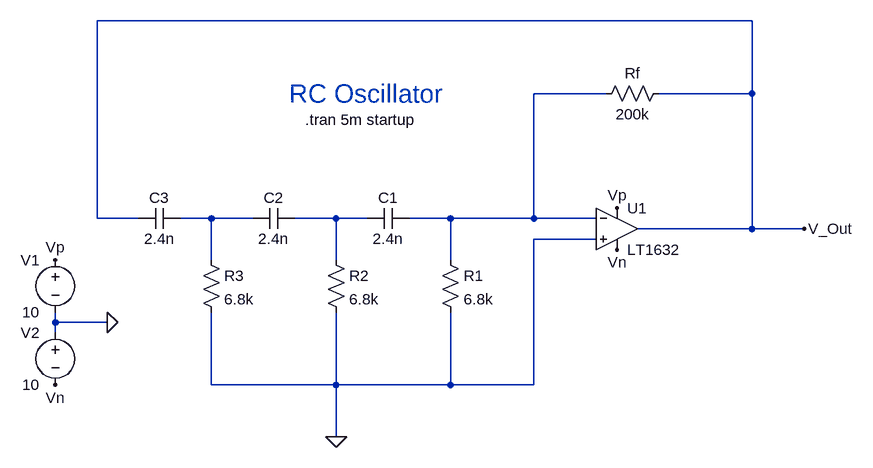
[diagram p0: schematic RC_Oscillator.asc]
RC_Oscillator.asc, the LTspice schematic file:
Version 4.1
SHEET 1 880 680
WIRE 480 -192 -528 -192
WIRE 256 -80 144 -80
WIRE 480 -80 480 -192
WIRE 480 -80 336 -80
WIRE -528 112 -528 -192
WIRE -464 112 -528 112
WIRE -352 112 -400 112
WIRE -288 112 -352 112
WIRE -160 112 -224 112
WIRE -112 112 -160 112
WIRE 16 112 -48 112
WIRE 144 112 144 -80
WIRE 144 112 16 112
WIRE 240 112 144 112
WIRE 480 128 480 -80
WIRE 480 128 304 128
WIRE 560 128 480 128
WIRE 240 144 144 144
WIRE -352 176 -352 112
WIRE -160 176 -160 112
WIRE 16 176 16 112
WIRE -592 272 -592 256
WIRE -512 272 -592 272
WIRE -592 288 -592 272
WIRE -352 368 -352 256
WIRE -160 368 -160 256
WIRE -160 368 -352 368
WIRE 16 368 16 256
WIRE 16 368 -160 368
WIRE 144 368 144 144
WIRE 144 368 16 368
WIRE -160 448 -160 368
FLAG -160 448 0
FLAG -592 176 Vp
FLAG 272 96 Vp
FLAG -592 368 Vn
FLAG 272 160 Vn
FLAG 560 128 V_Out
FLAG -512 272 0
SYMBOL cap -48 96 R90
WINDOW 0 0 32 VBottom 2
WINDOW 3 32 32 VTop 2
SYMATTR InstName C1
SYMATTR Value 2.4n
SYMBOL cap -224 96 R90
WINDOW 0 0 32 VBottom 2
WINDOW 3 32 32 VTop 2
SYMATTR InstName C2
SYMATTR Value 2.4n
SYMBOL cap -400 96 R90
WINDOW 0 0 32 VBottom 2
WINDOW 3 32 32 VTop 2
SYMATTR InstName C3
SYMATTR Value 2.4n
SYMBOL res -176 160 R0
SYMATTR InstName R2
SYMATTR Value 6.8k
SYMBOL res 0 160 R0
SYMATTR InstName R1
SYMATTR Value 6.8k
SYMBOL res -368 160 R0
SYMATTR InstName R3
SYMATTR Value 6.8k
SYMBOL res 352 -96 R90
WINDOW 0 0 56 VBottom 2
WINDOW 3 32 56 VTop 2
SYMATTR InstName Rf
SYMATTR Value 200k
SYMBOL voltage -592 160 M0
WINDOW 123 0 0 Left 0
WINDOW 39 0 0 Left 0
SYMATTR InstName V1
SYMATTR Value 10
SYMBOL OpAmps\\LT1632 272 64 R0
SYMATTR InstName U1
SYMBOL voltage -592 272 M0
WINDOW 123 0 0 Left 0
WINDOW 39 0 0 Left 0
SYMATTR InstName V2
SYMATTR Value 10
TEXT -208 -40 Left 2 !.tran 5m startup
TEXT -232 -80 Left 4 ;RC Oscillator

The netlist it stands for:
* RC_Oscillator.asc
C1 N001 N003 2.4n
C2 N003 N002 2.4n
C3 N002 V_Out 2.4n
R2 N003 0 6.8k
R1 N001 0 6.8k
R3 N002 0 6.8k
Rf V_Out N001 200k
V1 Vp 0 10
X§U1 0 N001 Vp Vn V_Out LT1632  ; pins In+ In- V+ V- OUT
V2 0 Vn 10
.tran 5m startup
* RC Oscillator
.lib LTC.lib
.backanno
.end